# Altium schematic sheet Slave_Sheet1.SchDoc
size A4
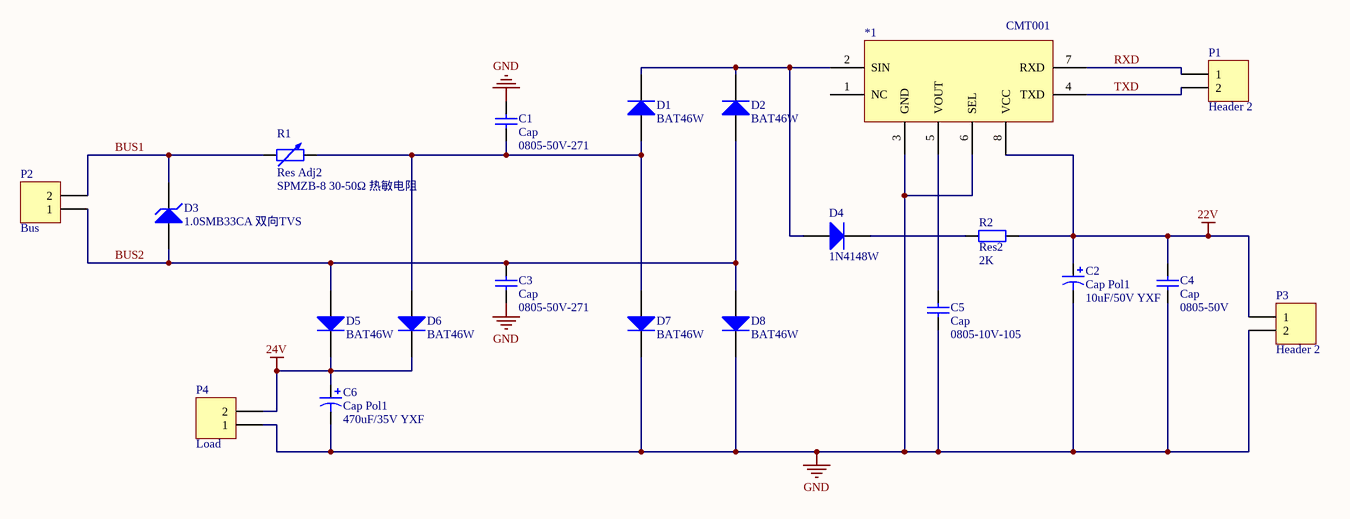
[diagram p0: Slave_Sheet1.SchDoc]

## Parts
*1  CMT001  [MSOP-MS8_M]
C1  Cap  value 0805-50V-271  [0805-1]
C2  Cap Pol1  value 10uF/50V YXF  [C-RB-8]
C3  Cap  value 0805-50V-271  [0805-1]
C4  Cap  value 0805-50V  [0805-1]
C5  Cap  value 0805-10V-105  [0805-1]
C6  Cap Pol1  value 470uF/35V YXF  [C-RB-12]
D1  BAT46W  [SOD-123]
D2  BAT46W  [SOD-123]
D3  1.0SMB33CA 双向TVS  [DIODE-SMB]
D4  1N4148W  [DO35]
D5  BAT46W  [SOD-123]
D6  BAT46W  [SOD-123]
D7  BAT46W  [SOD-123]
D8  BAT46W  [SOD-123]
P1  Header 2  [HDR1X2]
P2  Bus  [HDR1X2]
P3  Header 2  [HDR1X2]
P4  Load  [HDR1X2]
R1  Res Adj2  value SPMZB-8 30-50Ω 热敏电阻  [AXIAL-0.6]
R2  Res2  value 2K  [0805-1]

## Nets
22V: *1.8(VCC) C2.1 C4.2 P3.1 R2.2
24V: C6.1 D5.2(K) D6.2(K) P4.2
GND: *1.3(GND) *1.6(SEL) C1.2 C2.2 C3.1 C4.1 C5.1 C6.2 D7.2(K) D8.2(K) P3.2 P4.1
BUS1: D3.2(K) P2.2 R1.1
BUS2: C3.2 D2.1(A) D3.1(A) D5.1(A) D8.1(A) P2.1
RXD: *1.7(RXD) P1.1
TXD: *1.4(TXD) P1.2
Net*1_2: *1.2(SIN) D1.2(K) D2.2(K) D4.1(A)
Net*1_5: *1.5(VOUT) C5.2
NetC1_1: C1.1 D1.1(A) D6.1(A) D7.1(A) R1.2
NetD4_2: D4.2(K) R2.1

Not connected (* = marked no-connect by the designer): *1 1(NC)

## Library data of the parts
*1 = CMT001: 从机
C1 C3-C5 = Cap: Capacitor; Published: 8-Jun-2000; LatestRevisionDate: 17-Jul-2002; LatestRevisionNote: Re-released for DXP Platform.; PackageReference: RAD-0.3; Publisher: Altium Limited; PackageDescription: Radial Cap, Thru-Hole; 2 Leads; 0.3 in Pin Spacing
C2 C6 = Cap Pol1: Polarized Capacitor (Radial); Published: 8-Jun-2000; LatestRevisionDate: 17-Jul-2002; LatestRevisionNote: Re-released for DXP Platform.; PackageReference: RB7.6-15; Publisher: Altium Limited; PackageDescription: Polarized Capacitor (Radial); 2 Leads
D1 D2 D4-D8 = Diode: Default Diode; Published: 8-Jun-2000; LatestRevisionDate: 17-Jul-2002; LatestRevisionNote: Re-released for DXP Platform.; PackageVersion: Sep-1996; PackageReference: SMC; Publisher: Altium Limited; PackageDescription: DO-214-AB/SMC; 2 C-Bend Leads; Body 7.9 x 5.9 mm, inc. leads (LxW); Code_JEDEC: DO-214-AB
D3 = D Zener: Zener Diode; Published: 8-Jun-2000; LatestRevisionDate: 17-Jul-2002; LatestRevisionNote: Re-released for DXP Platform.; PackageReference: DIODE-0.7; Publisher: Altium Limited; PackageDescription: Diode, Thru-Hole; 2 Leads; 0.7 in Pin Spacing
P1-P4 = Header 2: Header, 2-Pin; LatestRevisionDate: 17-Jul-2002; LatestRevisionNote: Re-released for DXP Platform.; Publisher: Altium Limited
R1 = Res Adj2: Variable Resistor; Set Position: 0.5; Published: 8-Jun-2000; LatestRevisionDate: 17-Jul-2002; LatestRevisionNote: Re-released for DXP Platform.; PackageReference: AXIAL-0.6; Publisher: Altium Limited; PackageDescription: Axial Device, Thru-Hole; 2 Leads; 0.6 in Pin Spacing
R2 = Res2: Resistor; Published: 8-Jun-2000; LatestRevisionDate: 17-Jul-2002; LatestRevisionNote: Re-released for DXP Platform.; PackageReference: AXIAL-0.4; Publisher: Altium Limited; PackageDescription: Axial Device, Thru-Hole; 2 Leads; 0.4 in Pin Spacing